# Altium schematic sheet MMC5983MA.SchDoc
size A; SheetNumber: 7; SheetTotal: 14
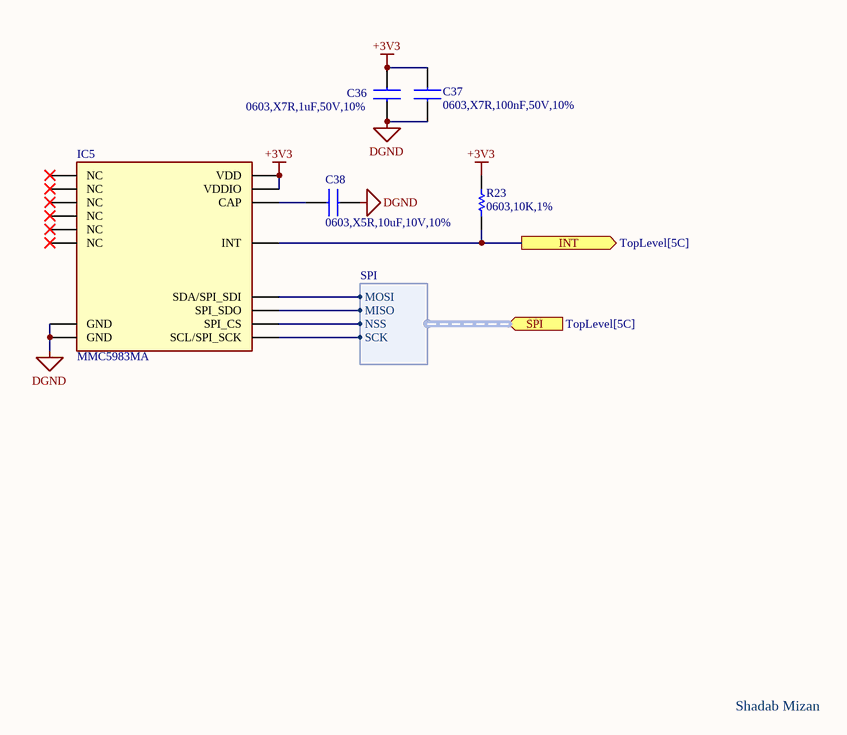
[diagram p0: MMC5983MA.SchDoc]

## Parts
C36  0603,X7R,1uF,50V,10%  [CAPC1608X90N]
C37  0603,X7R,100nF,50V,10%  [CAPC1608X90N]
C38  0603,X5R,10uF,10V,10%  [CAPC1608X90N]
IC5  MMC5983MA  [LGA-16_L3.0-W3.0-P0.50-BL_SQ]
R23  0603,10K,1%  [RESC1608X90N]

## Ports
INT (out, see TopLevel[5C]), SPI (in, harness SPI, see TopLevel[5C])

## Harnesses
SPI: NSS, SCK, MISO, MOSI

## Nets
+3V3: C36.2 C37.2 IC5.2(VDD) IC5.13(VDDIO) R23.2
DGND: C36.1 C37.1 C38.2 IC5.9(GND) IC5.11(GND)
INT: IC5.15(INT) R23.1 ; port INT
NetC38_1: C38.1 IC5.10(CAP)
NetIC5_1: IC5.1(SCL/SPI_SCK) ; port SPI.SCK
NetIC5_4: IC5.4(SPI_CS) ; port SPI.NSS
NetIC5_5: IC5.5(SPI_SDO) ; port SPI.MISO
NetIC5_16: IC5.16(SDA/SPI_SDI) ; port SPI.MOSI

Not connected (* = marked no-connect by the designer): IC5 3(NC)* 6(NC)* 7(NC)* 8(NC)* 12(NC)* 14(NC)*

## Notes on the sheet
- Shadab Mizan

## Library data of the parts
C36 = CL10A105KB8NNNC: 50V 1uF X7R ±10% 0603 Multilayer Ceramic Capacitors MLCC - SMD/SMT ROHS; LCSC Part #: C15849; Manu Part #: CL10A105KB8NNNC
C37 = CC0603KRX7R9BB104: 50V 100nF X7R ±10% 0603 Multilayer Ceramic Capacitors MLCC - SMD/SMT ROHS; LCSC Part #: C14663; Manu Part #: CC0603KRX7R9BB104
C38 = CL10A106KP8NNNC: 10uF ±10% 10V Ceramic Capacitor X5R 0603; LCSC Part #: C19702; Manu Part #: CL10A106KP8NNNC
IC5 = MMC5983MA: ±8 Gauss, High Performance 3-axis Magnetic Sensor; Manu Part #: MMC5983MA; LCSC Part #: C404329
R23 = 0603WAF1002T5E: 100mW Thick Film Resistor 75V ±100ppm/℃ ±1% 10kΩ 0603 Chip Resistor - Surface Mount ROHS; LCSC Part #: C25804; Manu Part #: 0603WAF1002T5E